# Altium schematic sheet Sheet3.SchDoc
size B; SheetNumber: 3; SheetTotal: 3
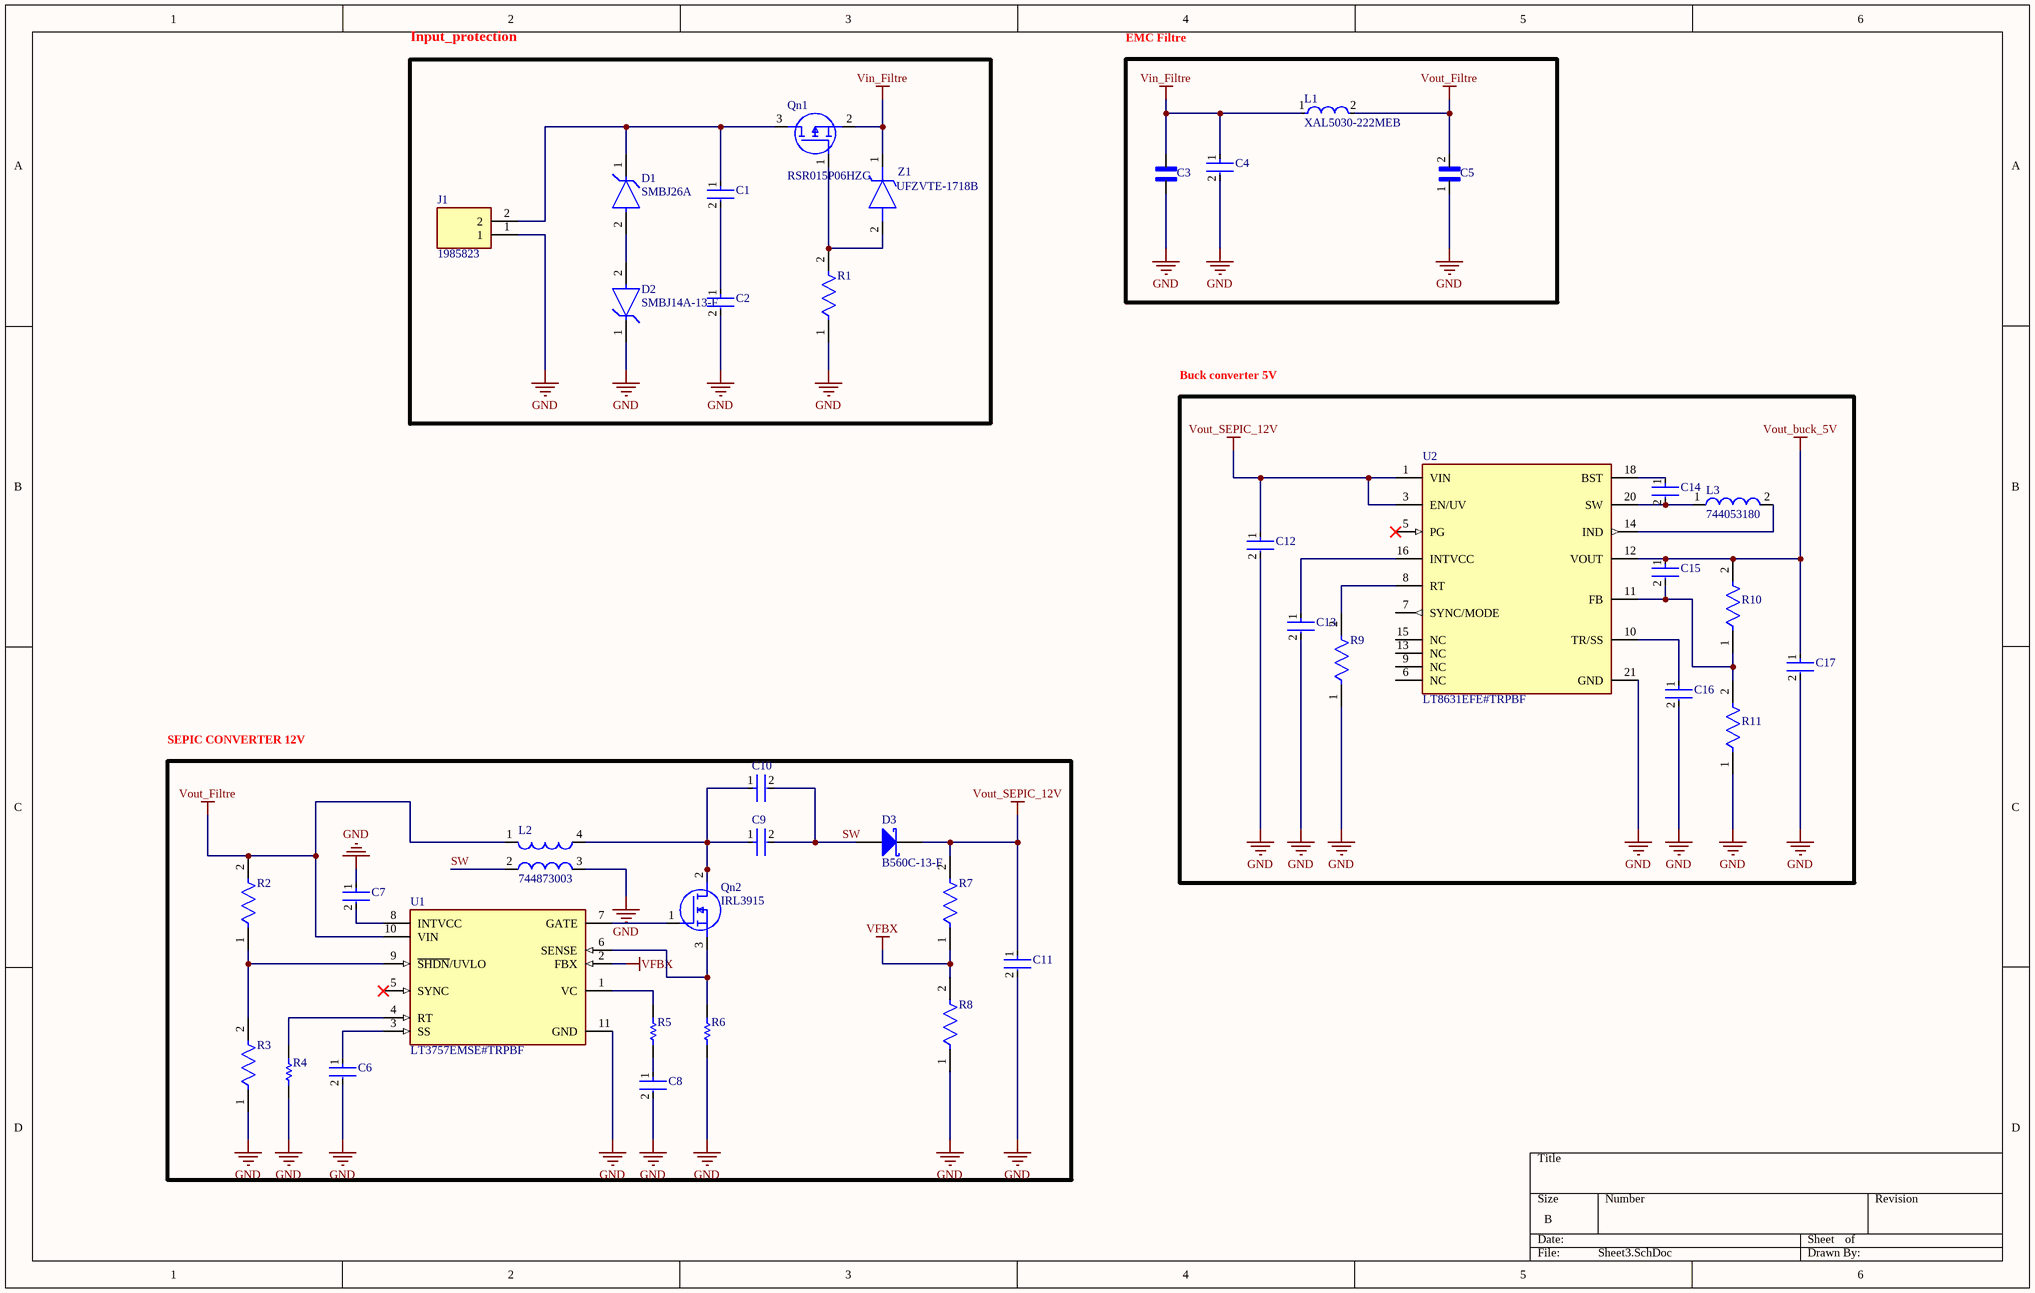
[diagram p0: Sheet3.SchDoc]

## Parts
C1  CGA2B3X7R1H104M050BB  [FP-CGA2B-MFG]  (value not drawn)
C2  CGA2B3X7R1H104M050BB  [FP-CGA2B-MFG]  (value not drawn)
C3  CGA9N3X7R1H106K230KB  [CAP_CGA9N3X7R1H106K230KB]  (value not drawn)
C4  C1210C225K5RACTU  [FP-C1210C225K5RACTU-MFG]  (value not drawn)
C5  C3216X5R0J686M160AB  [CAPC3216X190N]  (value not drawn)
C6  GRM1885C1H202JA01D  [FP-GRM188-0_1-e0_2_0_5-IPC_B]  (value not drawn)
C7  GRM155R60J475ME47D  [FP-GRM155-0_1-IPC_B]  (value not drawn)
C8  C1206C682K5RACTU  [FP-C1206C-EB-MFG]  (value not drawn)
C9  GRM155R60J475ME47D  [FP-GRM155-0_1-IPC_B]  (value not drawn)
C10  GRM155R60J475ME47D  [FP-GRM155-0_1-IPC_B]  (value not drawn)
C11  C0805C476M9PACTU  [FP-C0805C476M9PACTU-MFG]  (value not drawn)
C12  C0805C106K8PACTU  [FP-C0805C-DG-MFG]  (value not drawn)
C13  GRM188R71A225KE15D  [FP-GRM188-0_1-e0_2_0_5-MFG]  (value not drawn)
C14  C0603C104K5RACTU  [FP-C0603C-CF-MFG]  (value not drawn)
C15  C0402C479C5GACTU  [FP-C0402-BB-MFG]  (value not drawn)
C16  GRM1885C1H202JA01D  [FP-GRM188-0_1-e0_2_0_5-IPC_B]  (value not drawn)
C17  GRM31CR60J476ME19L  [FP-GRM31C-0_2-e0_3_0_8-IPC_C]  (value not drawn)
D1  SMBJ26A  [FP-SMBJ-MFG]
D2  SMBJ14A-13-F  [FP-SMB-MFG]
D3  B560C-13-F  [DIOD-B5X0C-2_M]
J1  1985823  [1985823]
L1  XAL5030-222MEB  [FP-XAL5030-222MEB-MFG]
L2  744873003  [WE-DD-XL]
L3  744053180  [WE-TPC-5828-LH]
Qn1  RSR015P06HZG  [SOT95P280X90-3N]
Qn2  IRL3915  [TO254P469X1042X1930-3P]
R1  CRCW040210K0FKEDC  [FP-CRCW0402-C-e3-IPC_C]  (value not drawn)
R2  RMCF0603FG100K  [FP-RMCF0603-IPC_C]  (value not drawn)
R3  CRCW080591K0FKEA  [FP-CRCW0805-e3-IPC_C]  (value not drawn)
R4  CRCW040226K1FKED  [RESC1005X40X25LL05T05]  (value not drawn)
R5  CRCW040210K0FKEDHP  [RESC1005X40X25ML05T10]  (value not drawn)
R6  WSL12068L000FEA  [RESC3216X89X51LL25T25]  (value not drawn)
R7  RC0603FR-07105KL  [FP-RC0603-0_55-IPC_B]  (value not drawn)
R8  RG1005N-1582-B-T5  [FP-RG1005-IPC_A]  (value not drawn)
R9  CRCW080519K6FKEA  [FP-CRCW0805-e3-IPC_C]  (value not drawn)
R10  RMCF0603JT1M00  [FP-RMCF0603-IPC_B]  (value not drawn)
R11  RG3216N-1913-B-T5  [FP-RG3216-IPC_A]  (value not drawn)
U1  LT3757EMSE#TRPBF  [FP-MSE-10-05-08-1664-IPC_C]
U2  LT8631EFE#TRPBF  [FP-FE-20_16_-05-08-1924-C-MFG]
Z1  UFZVTE-1718B  [SODFL2512X90N]

## Blocks framed on the sheet
Input_protection: C1 C2 D1 D2 J1 Qn1 R1 Z1
EMC Filtre: C3-C5 L1
Buck converter 5V: C12-C17 L3 R9-R11 U2
SEPIC CONVERTER 12V: C6-C11 D3 L2 Qn2 R2-R8 U1

## Nets
GND: C2.2 C3.1 C4.2 C5.1 C6.2 C7.1 C8.2 C11.2 C12.2 C13.2 C16.2 C17.2 D2.1(C) J1.1 L2.3 R1.1 R3.1 R4.1 R6.1 R8.1 R9.1 R11.1 U1.11(GND) U2.21(GND)
VFBX: R7.1 R8.2 U1.2(FBX)
Vin_Filtre: C3.2 C4.1 L1.1 Qn1.2(S) Z1.1(K)
Vout_buck_5V: C15.1 C17.1 R10.2 U2.12(VOUT)
Vout_Filtre: C5.2 L1.2 L2.1 R2.2 U1.10(VIN)
Vout_SEPIC_12V: C11.1 C12.1 D3.1(K) R7.2 U2.1(VIN) U2.3(EN/UV)
SW: C9.2 C10.2 D3.2(A) L2.2
NetC1_1: C1.1 D1.1(C) J1.2 Qn1.3(D)
NetC1_2: C1.2 C2.1
NetC6_1: C6.1 U1.3(SS)
NetC7_2: C7.2 U1.8(INTVCC)
NetC8_1: C8.1 R5.1
NetC9_1: C9.1 C10.1 L2.4 Qn2.2(D)
NetC13_1: C13.1 U2.16(INTVCC)
NetC14_1: C14.1 U2.18(BST)
NetC14_2: C14.2 L3.1 U2.20(SW)
NetC15_2: C15.2 R10.1 R11.2 U2.11(FB)
NetC16_1: C16.1 U2.10(TR/SS)
NetD1_2: D1.2(A) D2.2(A)
NetL3_2: L3.2 U2.14(IND)
NetQn1_1: Qn1.1(G) R1.2 Z1.2(A)
NetQn2_1: Qn2.1(G) U1.7(GATE)
NetQn2_3: Qn2.3(S) R6.2 U1.6(SENSE)
NetR2_1: R2.1 R3.2 U1.9(~{SHDN}/UVLO)
NetR4_2: R4.2 U1.4(RT)
NetR5_2: R5.2 U1.1(VC)
NetR9_2: R9.2 U2.8(RT)

Not connected (* = marked no-connect by the designer): U1 5(SYNC)*; U2 5(PG)* 6(NC) 7(SYNC/MODE) 9(NC) 13(NC) 15(NC)

## Library data of the parts
C1 C2 = CMP-08246-001395-1: Cap Ceramic 100nF 50V X7R 20% Pad SMD 0402 +125°C Automotive T/R; Width: 0.02inch; Capacitance: 100nF; Min Operating Temperature: -55°C; Length: 0.039inch; Tolerance: 20%; Case Code (Metric): 1005; Voltage Rating: 50V; Packaging: Tape and Reel; Ratings: AEC-Q200; Mount: Surface Mount; Thickness: 0.022inch; Package Quantity: 10000; Case Code (Imperial): 0402; Case/Package: 0402; Max Operating Temperature: 125°C
C3 = CGA9N3X7R1H106K230KB: 10 ÂµF Â±10% 50V Ceramic Capacitor X7R 2220 (5750 Metric); MF: TDK; Package: 2220-2 TDK; Availability: In Stock; Check_prices: https://www.snapeda.com/parts/CGA9N3X7R1H106K230KB/TDK/view-part/?ref=eda; Purchase-URL: https://pricing.snapeda.com/search/part/CGA9N3X7R1H106K230KB/?ref=eda; Value: *; MP: CGA9N3X7R1H106K230KB; SnapEDA_Link: https://www.snapeda.com/parts/CGA9N3X7R1H106K230KB/TDK/view-part/?ref=snap; Price: None
C4 = CMP-1038-02098-3: CAP CER 2.2UF 50V X7R 1210; Tolerance: 10%; Dielectric Material: Ceramic; Voltage: 100V; Packaging: Tape and Reel; Min Operating Temperature: -55°C; Mount: Surface Mount; Dielectric: X7R; Case Code (Imperial): 1210; RoHS Compliant: Yes; Construction: Flat; Package Quantity: 1; Voltage Rating: 50V; Series: C; REACH SVHC: No SVHC; Length: 3.2mm; Contact Plating: Tin; Height: 1.25mm; Capacitance: 2.2uF; Number of Pins: 2; Radiation Hardening: No; Termination: SMD/SMT; Max Operating Temperature: 125°C; Case Code (Metric): 3225; Voltage Rating (DC): 50V; Depth: 2.5mm; Width: 0.098inch; Thickness: 0.055inch; Case/Package: 1210
C5 = C3216X5R0J686M160AB: 68 ÂµF Â±20% 6.3V Ceramic Capacitor X5R 1206 (3216 Metric); MF: TDK; Check_prices: https://www.snapeda.com/parts/C3216X5R0J686M160AB/TDK/view-part/?ref=eda; Purchase-URL: https://pricing.snapeda.com/search/part/C3216X5R0J686M160AB/?ref=eda; Value: *; Availability: In Stock; Package: 3216 TDK; SnapEDA_Link: https://www.snapeda.com/parts/C3216X5R0J686M160AB/TDK/view-part/?ref=snap; MP: C3216X5R0J686M160AB; Price: None
C6 C16 = CMP-2006-02494-2: Chip Multilayer Ceramic Capacitors for General Purpose, 0603, 2000pF, C0G, 30ppm/°C, 5%, 50V; Capacitance: 2nF; Voltage Rating (DC): 50V; Depth: 0.8mm; Material: Ceramic; Package Quantity: 1; Packaging: Tape and Reel; Case Code (Imperial): 0603; Termination: SMD/SMT; Min Operating Temperature: -55°C; Dielectric: C0G; Tolerance: 5%; Case/Package: 0603; REACH SVHC: No SVHC; Max Operating Temperature: 125°C; Length: 1.6mm; Case Code (Metric): 1608; Voltage: 50V; Lead Free: Lead Free; Thickness: 0.035inch; Height: 0.8mm; Mount: Surface Mount; Radiation Hardening: No; Voltage Rating: 50V; Width: 0.8mm
C7 C9 C10 = CMP-2008-04549-2: Chip Multilayer Ceramic Capacitors for General Purpose, 0402, 4.7uF, X5R, 15%, 20%, 6.3V; Height: 0.5mm; Weight: 0.000212oz; Length: 1mm; Case Code (Metric): 1005; Packaging: Tape and Reel; Termination: SMD/SMT; Dielectric: X5R; Depth: 0.5mm; Case Code (Imperial): 0402; Min Operating Temperature: -55°C; Case/Package: 0402; Voltage: 6.3V; Width: 0.02inch; Capacitance: 4.7uF; Lead Free: Lead Free; Thickness: 0.022inch; Contact Plating: Tin; REACH SVHC: No SVHC; Package Quantity: 10000; Tolerance: 20%; Voltage Rating (DC): 6.3V; Voltage Rating: 6.3V; Mount: Surface Mount; Max Operating Temperature: 85°C
C8 = CMP-03020-014246-1: CAP CER 6800PF 50V X7R 1206; Manufacturer: KEMET; Value: 6,800 pF; Tolerance: 0.1; Temperature Coefficient: 15%; Automotive Grade: Grade 0; Material: Ceramic; Mouser Description: 1206 C 6.8nF Ceramic Multilayer Capacitor; 50 VDC; +125degC; X7R Dielec; +/-10%; RoHS: TRUE; Device Class L3: Ceramic Capacitors; Device Class L2: Capacitors; Octopart: https://octopart.com/c1206c682k5ractu-kemet-97937; Device Class L1: Passive Components; Category: Cap; Package: C1206C-EB; Temperature Range High: +150°C; Digikey Description: CAP CER 6800PF 50V X7R 1206; Automotive: Yes; Lead Free: Yes; Temperature: -55°C to +150°C; Manufacturer Part Number: C1206C682K5RACTU; Height: 0.88mm; ComponentLink2Description: Datasheet; Capacitance: 6,800 pF; Ipc Land Pattern Name: CAPC320160X78; ComponentLink2URL: https://content.kemet.com/datasheets/KEM_C1007_X8R_ULTRA_150C_SMD.pdf; Temperature Range Low: -55°C; Temperature Characteristic: X7R; Voltage Rating: 50 V
C11 = CMP-2007-01008-2: CAP CER 47UF 6.3V X5R 0805; Dielectric Material: Ceramic; Dissipation Factor: 5%; Tolerance: 20%; Case Code (Imperial): 0805; Mount: PCB; Width: 1.2mm; Package Quantity: 3000; Radiation Hardening: No; Packaging: Tape and Reel; Termination: SMD/SMT; Series: C0805C; Voltage: 6.3V; Depth: 1.25mm; Dielectric: X5R; Case Code (Metric): 2012; Length: 2mm; Case/Package: 0805; REACH SVHC: No SVHC; Voltage Rating (DC): 6.3V; Capacitance: 47uF; RoHS Compliant: Yes; Height: 1.25mm; Construction: Flat; Number of Pins: 2; Voltage Rating: 6.3V; Max Operating Temperature: 85°C; Min Operating Temperature: -55°C
C12 = CMP-2007-03243-2: CAP CER 10UF 10V X5R 0805; Manufacturer: Kemet; 3DS Part Number: 220-00001; Tolerance: 10%; Temperature Coefficient: 15%; Material: Ceramic; Device Class L2: Capacitors; Device Class L1: Passive Components; ComponentLink2URL: https://content.kemet.com/datasheets/KEM_C1006_X5R_SMD.pdf; Height: 1.4mm; Lead Free: Yes; Manufacturer Part Number: C0805C106K8PACTU; Digikey Description: CAP CER 10UF 10V X5R 0805; Octopart: https://octopart.com/c0805c106k8pactu-kemet-98697; Capacitance: 10uF; Value: 10uF; Temperature Range Low: -55°C; Temperature: -55°C to +85°C; Automotive: No; Mouser Description: CAP CER 10UF 10V X5R 0805; Ipc Land Pattern Name: CAPC200125X125; Temperature Range High: +85°C; Voltage: 10V; RoHS: TRUE; Device Class L3: Ceramic Capacitors; ComponentLink2Description: Datasheet; Voltage Rating: 10V; Package: C0805C-DG; Temperature Characteristic: X5R; Category: Cap
C13 = CMP-2006-02836-2: Chip Multilayer Ceramic Capacitors for General Purpose, 0603, 2.2uF, X7R, 15%, 10%, 10V; Case Code (Metric): 1608; Height: 0.8mm; Packaging: Cut Tape; Voltage: 10V; Lead Free: Lead Free; Min Operating Temperature: -55°C; Voltage Rating (DC): 10V; Max Operating Temperature: 125°C; Voltage Rating: 10V; Dielectric: X7R; Depth: 0.8mm; Case Code (Imperial): 0603; Termination: SMD/SMT; Case/Package: 0603; Number of Pins: 2; REACH SVHC: No SVHC; Mount: Surface Mount; Width: 0.031inch; Material: Ceramic; Capacitance: 2.2uF; Package Quantity: 1; Weight: 7.1E-05oz; Length: 1.6mm; Thickness: 0.035inch; Tolerance: 10%
C14 = CMP-2006-03061-2: CAP CER 0.1UF 50V X7R 0603; Manufacturer: KEMET; Tolerance: 0.1; Temperature Coefficient: 30ppm/°C; Material: Ceramic; Automotive Grade: Grade 1; Value: 0.10 μF; Temperature: -55°C to +125°C; RoHS: TRUE; Temperature Range High: +125°C; Lead Free: Yes; Octopart: https://octopart.com/c0603c104k5ractu-kemet-139244; Digikey Description: CAP CER 0.1UF 50V X7R 0603; Category: Cap; Package: C0603C-CF; ComponentLink2Description: Datasheet; Temperature Range Low: -55°C; Device Class L1: Passive Components; Voltage Rating: 50 V; Automotive: Yes; Device Class L3: Ceramic Capacitors; ComponentLink2URL: https://api.kemet.com/component-edge/download/datasheet/C0603C100J5GACAUTO.pdf; Capacitance: 0.10 μF; Device Class L2: Capacitors; Manufacturer Part Number: C0603C104K5RACTU; Temperature Characteristic: X7R; Height: 0.87mm
C15 = CMP-2008-03310-2: CAP CER 4.7PF 50V NP0 0402; Manufacturer: Kemet; Material: Ceramic; Tolerance: 0.25 pF; Temperature Coefficient: 15%; Temperature Characteristic: C0G; Manufacturer Part Number: C0402C479C5GACTU; Lead Free: Yes; Device Class L1: Passive Components; ComponentLink2Description: Datasheet; Temperature: -55°C to +125°C; Digikey Description: CAP CER 4.7PF 50V NP0 0402; Ipc Land Pattern Name: CAPC10050X50; ComponentLink2URL: https://content.kemet.com/datasheets/KEM_C1002_X7R_SMD.pdf; Octopart: https://octopart.com/c0402c479c5gactu-kemet-9144199; Mouser Description: Multilayer Ceramic Capacitors MLCC - SMD/SMT 50volts 4.7pF C0G .25pF; Automotive: No; Voltage Rating: 50 V; Device Class L3: Ceramic Capacitors; Capacitance: 4.7 pF; Category: Cap; Value: 4.7 pF; Package: C0402-BB; Height: 0.55mm; Temperature Range Low: -55°C; RoHS: TRUE; Device Class L2: Capacitors; Temperature Range High: +125°C
C17 = CMP-2000-06344-2: Chip Multilayer Ceramic Capacitors for General Purpose, 1206, 47uF, X5R, 15%, 20%, 6.3V; Package Quantity: 2000; Mount: Surface Mount; Length: 3.2mm; Thickness: 0.071inch; Lead Free: Lead Free; Tolerance: 20%; Width: 0.063inch; Depth: 1.6mm; Case/Package: 1206; Dielectric: X5R; Radiation Hardening: No; Packaging: Tape and Reel; Voltage Rating (DC): 6.3V; Termination: SMD/SMT; Height: 1.6mm; Max Operating Temperature: 85°C; Case Code (Metric): 3216; Case Code (Imperial): 1206; Voltage: 6.3V; Voltage Rating: 6.3V; Capacitance: 47uF; Min Operating Temperature: -55°C; Material: Ceramic; REACH SVHC: No SVHC
D1 = CMP-08607-000063-1: TVS DIODE 26V 42.1V DO214AA; Manufacturer: Littelfuse; Breakdown Voltage: 28.9V; Peak Pulse Power: 600W; Peak Pulse Current: 14.3A; Direction: Unidirectional; Number Of Channels: 1; Max Junction Temp: +150°C; Lead Free: Yes; Device Class L1: Circuit Protection; Height: 2.61mm; Device Class L3: unset; Reverse Standoff Voltage: 26V; ComponentLink2URL: https://www.littelfuse.com/~/media/electronics/datasheets/tvs_diodes/littelfuse_tvs_diode_smbj_datasheet.pdf.pdf; Automotive: No; Octopart: https://octopart.com/smbj26a-littelfuse-350771; Device Class L2: TVS Diodes; Clamping Voltage: 42.1V; Manufacturer Part Number: SMBJ26A; Temperature Range High: +150°C; Category: Diode; RoHS: TRUE; Temperature: -65°C to +150°C; Mouser Description: TVS Diodes - Transient Voltage Suppressors 26Vr 600W 14.3A 5% UniDirectional; Package: SMBJ; Digikey Description: TVS DIODE 26V 42.1V DO214AA; Temperature Range Low: -65°C; ComponentLink2Description: Datasheet
D2 = CMP-12828-000029-1: TVS DIODE 14V 23.2V SMB; Max Surge Current: 25.8A; Power Dissipation: 600W; Reverse Breakdown Voltage: 15.6V; Max Breakdown Voltage: 17.9V; Direction: Unidirectional; Forward Voltage: 5V; Leakage Current: 5uA; Test Current: 1mA; Capacitance: 1nF; Number of Elements: 1; Element Configuration: Single; Clamping Voltage: 23.2V; Number of Pins: 2; Case/Package: SMB; Voltage Rating (DC): 14V; Radiation Hardening: No; Termination: SMD/SMT; Length: 4.57mm; Working Voltage: 14V; Max Operating Temperature: 150°C; Peak Pulse Current: 25.8A; Packaging: Tape and Reel; Max Output Current: 25.8A; Lead Free: Lead Free; Breakdown Voltage: 15.6V; Width: 3.9mm; Package Quantity: 1; Mount: Surface Mount; Min Breakdown Voltage: 15.6V; Max Power Dissipation: 600W; Peak Pulse Power: 600W; Height: 2.62mm; Max Reverse Leakage Current: 5uA; Polarity: Unidirectional; Min Operating Temperature: -55°C; Reverse Standoff Voltage: 14V
D3 = CMP-2000-05098-2: Schottky Barrier Rectifier, 5 A, 60 V, -55 to 125 degC, 2-Pin SMD, RoHS, Tape and Reel; Ir - Reverse Current: 500uA; Configuration: Single; Ifsm - Forward Surge Current: 100A; Vrrm - Repetitive Reverse Voltage: 60V; Brand: DiodesIncorporated; Vf - Forward Voltage: 0.7V; If - Forward Current: 5A; Unit Weight: 0.007408oz; Type: SchottkyBarrierRectifier; Package / Case: SMC; Manufacturer URL: http://www.diodes.com/; Datasheet URL: https://datasheet.ciiva.com/27052/1538961-27052355.pdf; Factory Pack Quantity: 3000; Height: 2.5mm; Width: 6.22mm; Product Category: SchottkyDiodes&Rectifiers; Minimum Operating Temperature: -55C; Manufacturer: DiodesIncorporated; Datasheet Version: Rev. 7-2, 06/2007; Product: SchottkyDiodes; Maximum Operating Temperature: +125C; Operating Temperature Range: -55Cto+125C; Technology: Si; Length: 7.11mm; RoHS: True; Packaging: Reel; Termination Style: SMD/SMT; Series: B560; Mounting Style: SMD/SMT
J1 = 1985823: Connector; Manufacturer_Name: Phoenix Contact; Datasheet Link: http://www.phoenixcontact.com/gb/produkte/1985823; Height: 8.65mm; Manufacturer_Part_Number: 1985823; Mouser Part Number: 651-1985823; Mouser Price/Stock: https://www.mouser.co.uk/ProductDetail/Phoenix-Contact/1985823?qs=YbgdthCBnKeJF1NhvxNKlA%3D%3D; Arrow Part Number: 1985823; Arrow Price/Stock: https://www.arrow.com/en/products/1985823/phoenix-contact?region=nac
L1 = CMP-11268-000050-1: Fixed Inductors 2.2uH 20% 9.7A 14.5mOhms; DC Resistance (DCR): 14.5mR; Shielding: Shielded; Max DC Current: 9.2A; Test Frequency: 100kHz; Self Resonant Frequency: 38MHz; Core Material: Composite; Lead Free: Contains Lead; Inductance: 2.2uH; Max Operating Temperature: 125°C; Termination: SMD/SMT; Min Operating Temperature: -40°C; Height: 3.1mm; Package Quantity: 20; Packaging: Tape and Reel; Tolerance: 20%; Length: 5.68mm; Width: 5.48mm
L2 = CMP-0228-00020-1: SMD Shielded Coupled Inductor WE-DD, L = 3.30 µH; Inductance: 3.30 ÂµH; PackageVersion: 2006; DatasheetVersion: ver 1, Nov-2009; PackageDescription: SMD Inductor, 4-Leads, Body 12.5 x 12.5 mm; ComponentLink1Description: Manufacturer Link; ComponentLink2URL: http://www.we-online.de/katalog/media/pdf/744873003.pdf; ComponentLink2Description: Datasheet; PackageReference: WE-DD-XL; ComponentLink1URL: http://www.we-online.com
L3 = CMP-0227-00382-1: SMD Shielded Tiny Power Inductor WE-TPC, L = 18.0 µH; Inductance: 18.0 ÂµH; ComponentLink2Description: Datasheet; ComponentLink1URL: http://www.we-online.com; ComponentLink2URL: http://www.we-online.de/katalog/media/pdf/744053180.pdf; PackageVersion: 2010; DatasheetVersion: ver 6, Aug-2010; PackageReference: WE-TPC-5828-LH; PackageDescription: SMD Inductor, 2-Leads, Body 5.8 x 5.8 mm; ComponentLink1Description: Manufacturer Link
Qn1 = RSR015P06HZG: MOSFET (P-Channel); Manufacturer_Name: ROHM Semiconductor; Datasheet Link: https://fscdn.rohm.com/en/products/databook/datasheet/discrete/transistor/mosfet/rsr015p06hzgtl-e.pdf; Height: 0.9mm; Manufacturer_Part_Number: RSR015P06HZG
Qn2 = IRL3705NPBF: MOSFET (N-Channel); Manufacturer_Name: Infineon; Datasheet Link: https://www.infineon.com/dgdl/irl3705n.pdf?fileId=5546d462533600a40153565f29f42532; Height: 4.69mm; Manufacturer_Part_Number: IRL3705NPBF; Mouser Part Number: 942-IRL3705NPBF; Mouser Price/Stock: https://www.mouser.co.uk/ProductDetail/Infineon-Technologies/IRL3705NPBF?qs=9%252BKlkBgLFf3RbtP30EBJKw%3D%3D; Arrow Part Number: IRL3705NPBF; Arrow Price/Stock: https://www.arrow.com/en/products/irl3705npbf/infineon-technologies-ag?region=europe
R1 = CMP-02407-012085-1: RES 10K OHM 1% 1/16W 0402; Temperature Coefficient: 100ppm/°C; Power Rating: 62.5mW; Resistance: 10kR; Lead Free: Lead Free; Max Operating Temperature: 155°C; RoHS Compliant: Yes; Mount: Surface Mount; Min Operating Temperature: -55°C; Termination: Wraparound; Length: 1mm; Resistor Type: Thick Film; Contact Plating: Tin; Tolerance: 1%; Case/Package: Molded
R2 = CMP-26527-003892-1: 100kΩ ±1% 0.1W 0603 Thick Film Chip Resistor AEC-Q200 compliant; Temperature Coefficient: 100ppm/°C; Resistance: 100kR; Max Power Dissipation: 100mW; Max Operating Temperature: 155°C; Length: 0.061inch; Lead Free: Lead Free; Height: 0.022inch; Resistor Type: Thick Film; Radiation Hardening: No; Features: Automotive AEC-Q200; Case Code (Metric): 1608; Mount: Surface Mount; Case Code (Imperial): 0603; Contact Plating: Tin; Case/Package: 0603; Tolerance: 1%; RoHS Compliant: Yes; Width: 0.031inch; Number of Terminations: 2; Packaging: Tape and Reel; Series: RMCF; Min Operating Temperature: -55°C
R3 = CMP-2001-04165-2: RES Thick Film, 91kΩ, 1%, 0.125W, 100ppm/°C, 0805; Max Power Dissipation: 125mW; Voltage Rating: 150V; Resistance: 91kR; Military Standard: Not; Height: 0.45mm; Length: 2mm; Case/Package: 0805; Tolerance: 1%; Min Operating Temperature: -55°C; Features: Automotive AEC-Q200; Depth: 1.25mm; Number of Pins: 2; Termination: SMD/SMT; Packaging: Tape and Reel; Weight: 0.000194oz; Package Quantity: 5000; Case Code (Metric): 2012; Width: 0.049inch; Radiation Hardening: No; Case Code (Imperial): 0805; Number of Terminations: 2; Contact Plating: Tin; Temperature Coefficient: 100ppm/°C; Composition: Thick Film; Mount: Surface Mount; Max Operating Temperature: 155°C; Power Rating: 125mW
R4 = CMP-2002-08422-1: Manufacturer: Vishay Dale; Part Number: CRCW040226K1FKED
R5 = CMP-2002-03043-1: Manufacturer: Vishay Dale; Part Number: CRCW040210K0FKEDHP
R6 = CMP-2003-04343-1: Manufacturer: Vishay Dale; Part Number: WSL12068L000FEA
R7 = CMP-03412-037815-1: RES SMD 105K OHM 1% 1/10W 0603; Max Power Dissipation: 100mW; Temperature Coefficient: 100ppm/°C; Voltage Rating: 75V; Resistance: 105kR; Voltage Rating (DC): 50V; RoHS Compliant: Yes; Lead Free: Lead Free; Case Code (Metric): 1608; Length: 1.6mm; Case/Package: 0603; Min Operating Temperature: -55°C; Weight: 7.1E-05oz; Resistor Type: Thick Film; Case Code (Imperial): 0603; Number of Terminations: 2; Power Rating: 100mW; Construction: Rectangular; Features: Moisture Resistant; Width: 0.031inch; Tolerance: 1%; Package Quantity: 1; Military Standard: Not; Height: 0.45mm; Size Code: 0603; Packaging: Tape and Reel; Mount: Surface Mount; Max Operating Temperature: 155°C; Depth: 0.8mm; Termination: SMD/SMT; Series: RC; Technology: THICK FILM
R8 = CMP-28537-009954-1: Automotive Metal Thin Film Chip Resistor, 0402, 15.8kΩ, 0.1%, 10ppm/°C, 0.0625W, 75V; Voltage Rating (DC): 25V; Power Rating: 63mW; Resistance: 15.8kR; Weight: 2.3E-05oz; Lead Free: Lead Free; Resistor Type: Thin Film; Length: 1mm; Packaging: Tape and Reel; Case Code (Imperial): 0402; Width: 0.5mm; Max Operating Temperature: 155°C; Number of Terminations: 2; Tolerance: 0.1%; RoHS Compliant: Yes; Temperature Coefficient: 10ppm/°C; Features: Automotive AEC-Q200; Min Operating Temperature: -55°C; Case Code (Metric): 1005; Voltage Rating: 75V; Max Power Dissipation: 63mW; Height: 0.35mm; Case/Package: 0402; Termination: SMD/SMT; Series: RG
R9 = CMP-2001-03594-2: RES Thick Film, 19.6kΩ, 1%, 0.125W, 100ppm/°C, 0805; Resistance: 19.6kR; Max Power Dissipation: 125mW; Voltage Rating: 150V; Termination: SMD/SMT; Number of Pins: 2; Package Quantity: 10; Max Operating Temperature: 155°C; Number of Terminations: 2; Min Operating Temperature: -55°C; Military Standard: Not; Power Rating: 125mW; Width: 0.049inch; Composition: Thick Film; Case/Package: 0805; Temperature Coefficient: 100ppm/°C; Case Code (Metric): 2012; Tolerance: 1%; Radiation Hardening: No; Packaging: Tape and Reel; Features: Automotive AEC-Q200; Depth: 1.25mm; Voltage Rating (DC): 150V; Height: 0.45mm; Case Code (Imperial): 0805; Length: 2mm; Lead Free: Lead Free; Contact Plating: Tin; Weight: 0.000194oz
R10 = CMP-26527-000361-1: 1MΩ ±5% 0.1W 0603 Thick Film Chip Resistor AEC-Q200 compliant; Max Power Dissipation: 100mW; Working Voltage: 75V; Resistance: 1MR; Temperature Coefficient: 200ppm/°C; Mount: Surface Mount; Resistor Type: Thick Film; Case Code (Imperial): 0603; Lead Free: Lead Free; Tolerance: 5%; Min Operating Temperature: -55°C; Construction: Rectangular; Depth: 0.8mm; Series: RMCF; RoHS Compliant: Yes; Width: 0.031inch; Height: 0.022inch; Case Code (Metric): 1608; Power Rating: 100mW; Military Standard: Not; Technology: THICK FILM; Radiation Hardening: No; Length: 1.55mm; Case/Package: 0603; Contact Plating: Tin; Packaging: Tape and Reel; Features: Automotive AEC-Q200; Number of Terminations: 2; Max Operating Temperature: 155°C
R11 = CMP-2003-02633-3: Automotive Metal Thin Film Chip Resistor, 1206, 191kΩ, 0.1%, 10ppm/°C, 0.25W, 200V; Max Power Dissipation: 250mW; Resistance: 191kR; Case Code (Imperial): 1206; RoHS Compliant: Yes; Lead Free: Lead Free; Termination: SMD/SMT; Voltage Rating: 200V; Weight: 0.000571oz; Size Code: 1206; Max Operating Temperature: 155°C; Case/Package: 1206; Power Rating: 250mW; Height: 0.4mm; Tolerance: 0.1%; Length: 3.2mm; Number of Terminations: 2; Voltage Rating (DC): 200V; Width: 1.6mm; Series: RG; Case Code (Metric): 3216; Packaging: Tape and Reel; Features: Automotive AEC-Q200; Min Operating Temperature: -55°C; Temperature Coefficient: 10ppm/°C; Resistor Type: Thin Film
U1 = CMP-09139-000262-1: IC REG CTRLR MULT TOP 10MSOP; Number of Outputs: 1; Output Voltage: 350V; Max Frequency: 1MHz; Number of Pins: 10; Package Quantity: 2500; RoHS Compliant: Yes; Min Operating Temperature: -40°C; Case/Package: MSOP; Packaging: Tape and Reel; Max Operating Temperature: 125°C; Lead Free: Lead Free; Mount: Surface Mount
U2 = CMP-09139-000564-1: IC REG BUCK ADJ 1A 20TSSOP; Max Output Voltage: 60V; Min Input Voltage: 3V; Output Configuration: Positive; Output Type: Adjustable; Max Input Voltage: 100V; Synchronous Rectifier: Yes; Min Output Voltage: 800mV; Switching Frequency: 1MHz; Number of Outputs: 1; Series: -; Max Operating Temperature: 125°C; RoHS Compliant: Yes; Output Voltage: 60V; Output Current: 1A; Number of Pins: 20; Packaging: Tape and Reel; Min Operating Temperature: -40°C; Mount: Surface Mount; Case/Package: TSSOP
Z1 = UFZVTE-1718B: Zener Diode; Manufacturer_Name: ROHM Semiconductor; Datasheet Link: https://fscdn.rohm.com/jp/products/databook/datasheet/discrete/diode/zener/ufzvte-1718b-j.pdf; Height: 0.9mm; Manufacturer_Part_Number: UFZVTE-1718B